# Altium schematic sheet [01] - COVER PAGE.SchDoc
size Letter; Author: Paola Andrea Ayala Pineda; Organization: Altium Limited; Address1: L3, 12a Rodborough Rd; Address2: Frenchs Forest; Address3: NSW; Address4: Australia 2086; Revision: 1.0; SheetNumber: 1; SheetTotal: 5; Carnet: 19091
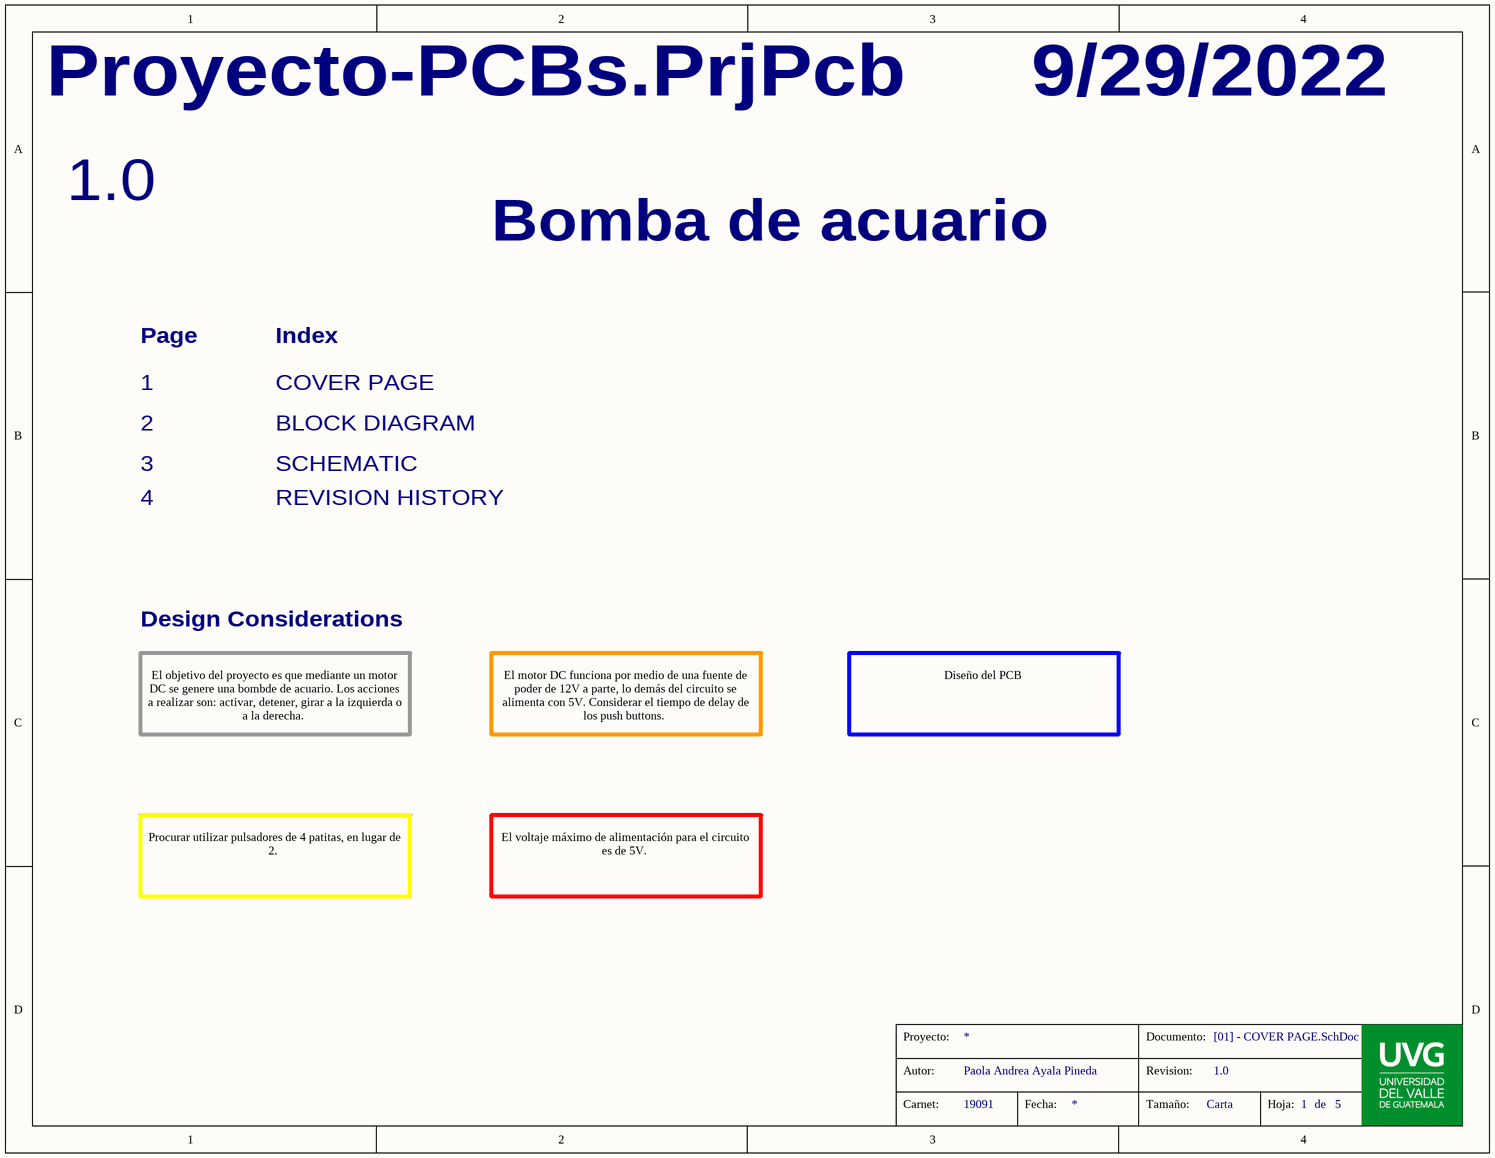
[diagram p0: [01] - COVER PAGE.SchDoc]

## Notes on the sheet
- Proyecto-PCBs.PrjPcb
- 9/29/2022
- 1.0
- Bomba de acuario
- Page
- Index
- 1
- 2
- COVER PAGE
- BLOCK DIAGRAM
- 3
- 4
- SCHEMATIC
- REVISION HISTORY
- Design Considerations
- El objetivo del proyecto es que mediante un motor DC se genere una bombde de acuario. Los acciones a realizar son: activar, detener, girar a la izquierda o a la derecha.
- El motor DC funciona por medio de una fuente de poder de 12V a parte, lo demás del circuito se alimenta con 5V. Considerar el tiempo de delay de los push buttons.
- Diseño del PCB
- Procurar utilizar pulsadores de 4 patitas, en lugar de 2.
- El voltaje máximo de alimentación para el circuito es de 5V.
- Proyecto:
- Documento:
- Autor:
- Carnet:
- Fecha:
- Revision:
- Tamaño:
- Carta
- Hoja:
- de